# EAGLE design SMC_FrontPanel_ExtensionBoard_Step2_V14_1 (EAGLE 9.6.2)
SIZE: 0.04

## Sheet 1 of 2
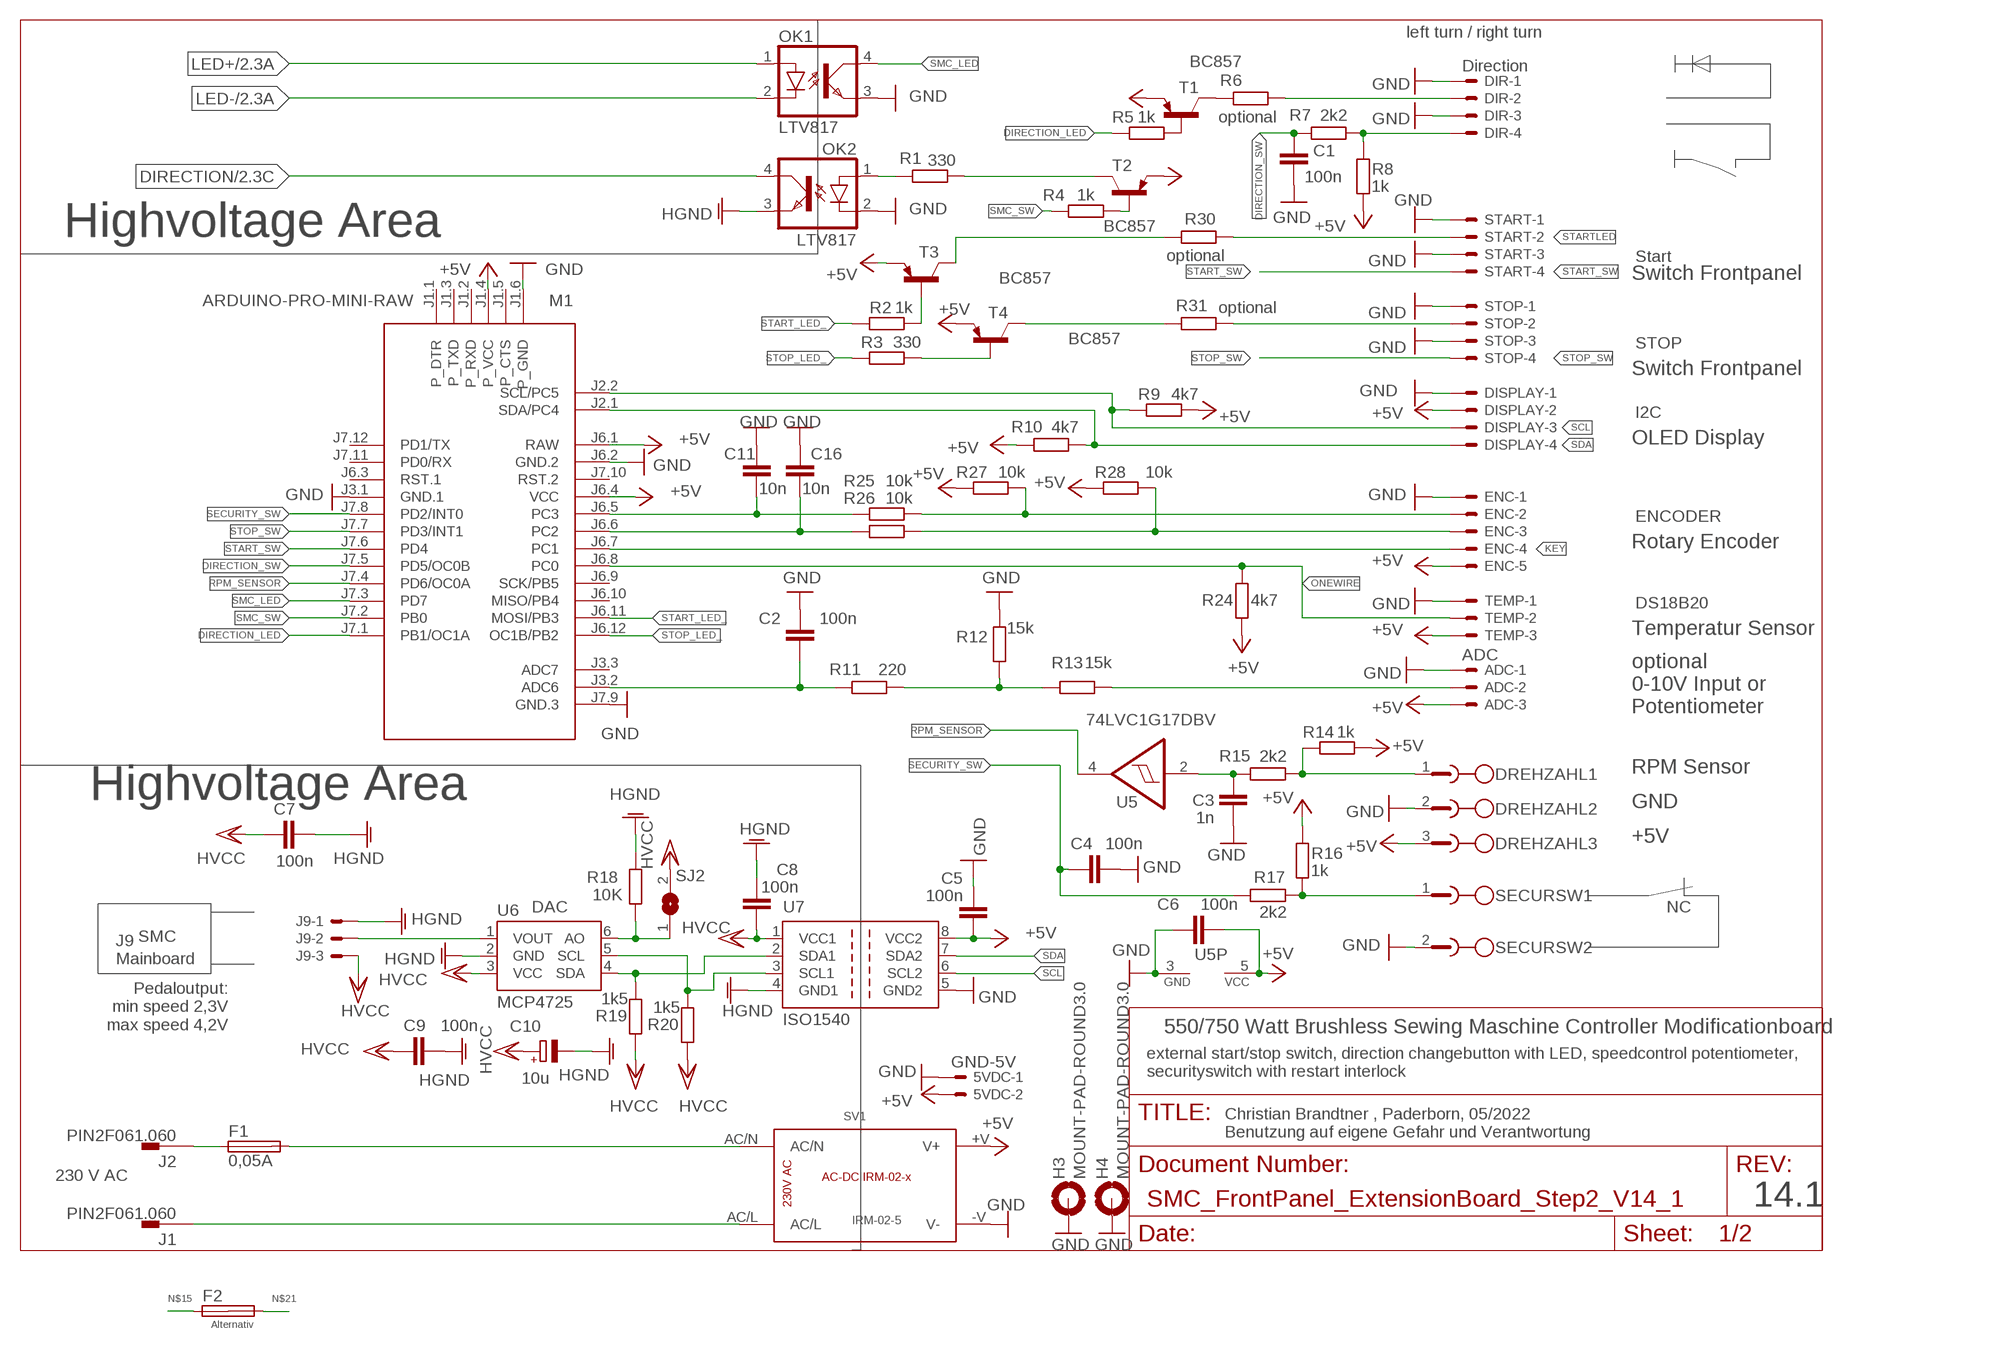
[diagram p0: schematic, sheet 1]

### Parts
5VDC  GND-5V  JST-XH-02-PIN-ROUND-PAD  [JST-XH-02-PACKAGE-ROUND-PAD]
ADC  ADC  JST-XH-03-PIN-ROUND-PAD  [JST-XH-03-PACKAGE-ROUND-PAD]
C1  100n  C-EUC0805  [C0805]
C2  100n  C-EUC0805  [C0805]
C3  1n  C-EUC0805  [C0805]
C4  100n  C-EUC0805  [C0805]
C5  100n  C-EUC0805  [C0805]
C6  100n  C-EUC0805  [C0805]
C7  100n  C-EUC0805  [C0805]
C8  100n  C-EUC0805  [C0805]
C9  100n  C-EUC0805  [C0805]
C10  10u  CPOL-EU153CLV-0405  [153CLV-0405]
C11  10n  C-EUC0805  [C0805]
C16  10n  C-EUC0805  [C0805]
DIR  Direction  JST-XH-04-PIN-ROUND-PAD  [JST-XH-04-PACKAGE-ROUND-PAD]
DISPLAY  I2C  JST-XH-04-PIN-ROUND-PAD  [JST-XH-04-PACKAGE-ROUND-PAD]
DREHZAHL  MCV_1.5/3/-G-3.5  [1843619]
ENC  ENCODER  JST-XH-05-PIN-ROUND-PAD  [JST-XH-05-PACKAGE-ROUND-PAD]
F1  0,05A  FUSE  [MTA501100]
F2  SHK20L  [SHK20L]
H3  MOUNT-PAD-ROUND3.0  [3,0-PAD]
H4  MOUNT-PAD-ROUND3.0  [3,0-PAD]
J1  PIN2F061.060  [F061.060]
J2  PIN2F061.060  [F061.060]
J9  JST-XH-03-PIN-ROUND-PAD  [JST-XH-03-PACKAGE-ROUND-PAD]
M1  ARDUINO-PRO-MINI-RAW  [ARDUINO-PRO-MINI]
OK1  LTV817  SFH6186-2  [SMD4-7]
OK2  LTV817  SFH6186-2  [SMD4-7]
R1  330  R-EU_R0805  [R0805]
R2  1k  R-EU_R0805  [R0805]
R3  330  R-EU_R0805  [R0805]
R4  1k  R-EU_R0805  [R0805]
R5  1k  R-EU_R0805  [R0805]
R6  optional  R-EU_R0805  [R0805]
R7  2k2  R-EU_R0805  [R0805]
R8  1k  R-EU_R0805  [R0805]
R9  4k7  R-EU_R0805  [R0805]
R10  4k7  R-EU_R0805  [R0805]
R11  220  R-EU_R0805  [R0805]
R12  15k  R-EU_R0805  [R0805]
R13  15k  R-EU_R0805  [R0805]
R14  1k  R-EU_R0805  [R0805]
R15  2k2  R-EU_R0805  [R0805]
R16  1k  R-EU_R0805  [R0805]
R17  2k2  R-EU_R0805  [R0805]
R18  10K  R-EU_R0805  [R0805]
R19  1k5  R-EU_R0805  [R0805]
R20  1k5  R-EU_R0805  [R0805]
R24  4k7  R-EU_R0805  [R0805]
R25  10k  R-EU_R0805  [R0805]
R26  10k  R-EU_R0805  [R0805]
R27  10k  R-EU_R0805  [R0805]
R28  10k  R-EU_R0805  [R0805]
R30  optional  R-EU_R0805  [R0805]
R31  optional  R-EU_R0805  [R0805]
SECURSW  MCV_1,5/2-G-3,5  [1843606]
SJ2  SJ  [SJ]
START  Start  JST-XH-04-PIN-ROUND-PAD  [JST-XH-04-PACKAGE-ROUND-PAD]
STOP  STOP  JST-XH-04-PIN-ROUND-PAD  [JST-XH-04-PACKAGE-ROUND-PAD]
SV1  IRM-02-5  IRM-02-X  [IRM-02-X]
T1  BC857  BC857ASMD  [SOT23-BEC]
T2  BC857  BC857ASMD  [SOT23-BEC]
T3  BC857  BC857ASMD  [SOT23-BEC]
T4  BC857  BC857ASMD  [SOT23-BEC]
TEMP  DS18B20  JST-XH-03-PIN-ROUND-PAD  [JST-XH-03-PACKAGE-ROUND-PAD]
U5  74LVC1G17DBV  [SOT23-5]
U6  MCP4725  MCP4725SOT-23  [SOT23-6]
U7  ISO1540  [SO-08]

### Nets
+5V: 5VDC.2 ADC.3 C5.1 C6.1 DISPLAY.2 DREHZAHL.3 ENC.5 M1.J1.4(P_VCC) M1.J6.1(RAW) M1.J6.4(VCC) R8.2 R9.1 R10.1 R14.1 R16.1 R24.2 R27.1 R28.1 SV1.+V(V+) T1.E T2.E T3.E T4.E TEMP.3 U5.5(VCC) U7.8(VCC2)
ADC_POTI: C2.1 M1.J3.2(ADC6) R11.1
DIRECTION: OK2.4(COL) ; also sheet 2
DIRECTION_LED: M1.J7.1(PB1/OC1A) R5.2
DIRECTION_SW: C1.2 M1.J7.5(PD5/OC0B) R7.1
GND: 5VDC.1 ADC.1 C1.1 C2.2 C3.1 C4.2 C5.2 C6.2 C11.2 C16.2 DIR.1 DIR.3 DISPLAY.1 DREHZAHL.2 ENC.1 H3.B3,0(MOUNT) H4.B3,0(MOUNT) M1.J1.6(P_GND) M1.J3.1(GND.1) M1.J6.2(GND.2) M1.J7.9(GND.3) OK1.3(EMIT) OK2.2(C) R12.2 SECURSW.2 START.1 START.3 STOP.1 STOP.3 SV1.-V(V-) TEMP.1 U5.3(GND) U7.5(GND2)
HGND: C7.1 C8.2 C9.1 C10.- J9.1 OK2.3(EMIT) R18.1 U6.2(GND) U7.4(GND1) ; also sheet 2
HVCC: C7.2 C8.1 C9.2 C10.+ J9.3 R19.2 R20.2 SJ2.2 U6.3(VCC) U7.1(VCC1) ; also sheet 2
KEY: ENC.4 M1.J6.7(PC1)
LED+: OK1.1(A) ; also sheet 2
LED-: OK1.2(C) ; also sheet 2
N$2: OK2.1(A) R1.2
N$4: J9.2 U6.1(VOUT)
N$5: R1.1 T2.C
N$6: R30.1 START.2
N$7: R2.1 T3.B
N$8: C3.2 R15.1 U5.2(I)
N$11: R3.1 T4.B
N$14: R18.2 SJ2.1 U6.6(AO)
N$15: F1.1 F2.1A J2.A1 J2.A2
N$16: DREHZAHL.1 R14.2 R15.2
N$17: R16.2 R17.2 SECURSW.1
N$18: R31.2 T4.C
N$19: R11.2 R12.1 R13.2
N$20: ADC.2 R13.1
N$21: F1.2 F2.2A SV1.AC/N
N$22: J1.A1 J1.A2 SV1.AC/L
N$23: R6.2 T1.C
N$24: DIR.2 R6.1
N$25: R5.1 T1.B
N$26: R4.1 T2.B
N$28: R20.1 U6.5(SCL) U7.3(SCL1)
N$29: DIR.4 R7.2 R8.1
N$30: C16.1 M1.J6.6(PC2) R26.1
N$31: C11.1 M1.J6.5(PC3) R25.1
N$32: ENC.2 R25.2 R27.2
N$33: ENC.3 R26.2 R28.2
N$34: R31.1 STOP.2
ONEWIRE: M1.J6.8(PC0) R24.1 TEMP.2
RPM_SENSOR: M1.J7.4(PD6/OC0A) U5.4(O)
SCL: DISPLAY.3 M1.J2.2(SCL/PC5) R9.2 U7.6(SCL2)
SDA: DISPLAY.4 M1.J2.1(SDA/PC4) R10.2 U7.7(SDA2)
SDA_HV: R19.1 U6.4(SDA) U7.2(SDA1)
SECURITY_SW: C4.1 M1.J7.8(PD2/INT0) R17.1
SMC_LED: M1.J7.3(PD7) OK1.4(COL)
SMC_SW: M1.J7.2(PB0) R4.2
START_LED_: M1.J6.11(MOSI/PB3) R2.2
START_SW: M1.J7.6(PD4) START.4
STARTLED: R30.2 T3.C
STOP_LED_: M1.J6.12(OC1B/PB2) R3.2
STOP_SW: M1.J7.7(PD3/INT1) STOP.4
Unconnected: F2.1B F2.2B M1.J1.1(P_DTR) M1.J1.2(P_RXD) M1.J1.3(P_TXD) M1.J1.5(P_CTS) M1.J3.3(ADC7) M1.J6.3(RST.1) M1.J6.9(SCK/PB5) M1.J6.10(MISO/PB4) M1.J7.10(RST.2) M1.J7.11(PD0/RX) M1.J7.12(PD1/TX)

### Notes on the sheet
- left turn / right turn
- Highvoltage Area
- Switch Frontpanel
- Switch Frontpanel
- OLED Display
- Rotary Encoder
- Temperatur Sensor
- optional
  0-10V Input or
  Potentiometer
- RPM Sensor
- Highvoltage Area
- GND
- +5V
- DAC | NC
- SMC
- J9
  Mainboard
- Pedaloutput:
  min speed 2,3V
  max speed 4,2V
- 550/750 Watt Brushless Sewing Maschine Controller Modificationboard
- external start/stop switch, direction changebutton with LED, speedcontrol potentiometer,
  securityswitch with restart interlock
- Christian Brandtner , Paderborn, 05/2022
  Benutzung auf eigene Gefahr und Verantwortung
- 230 V AC
- 14.1
- Alternativ

## Sheet 2 of 2
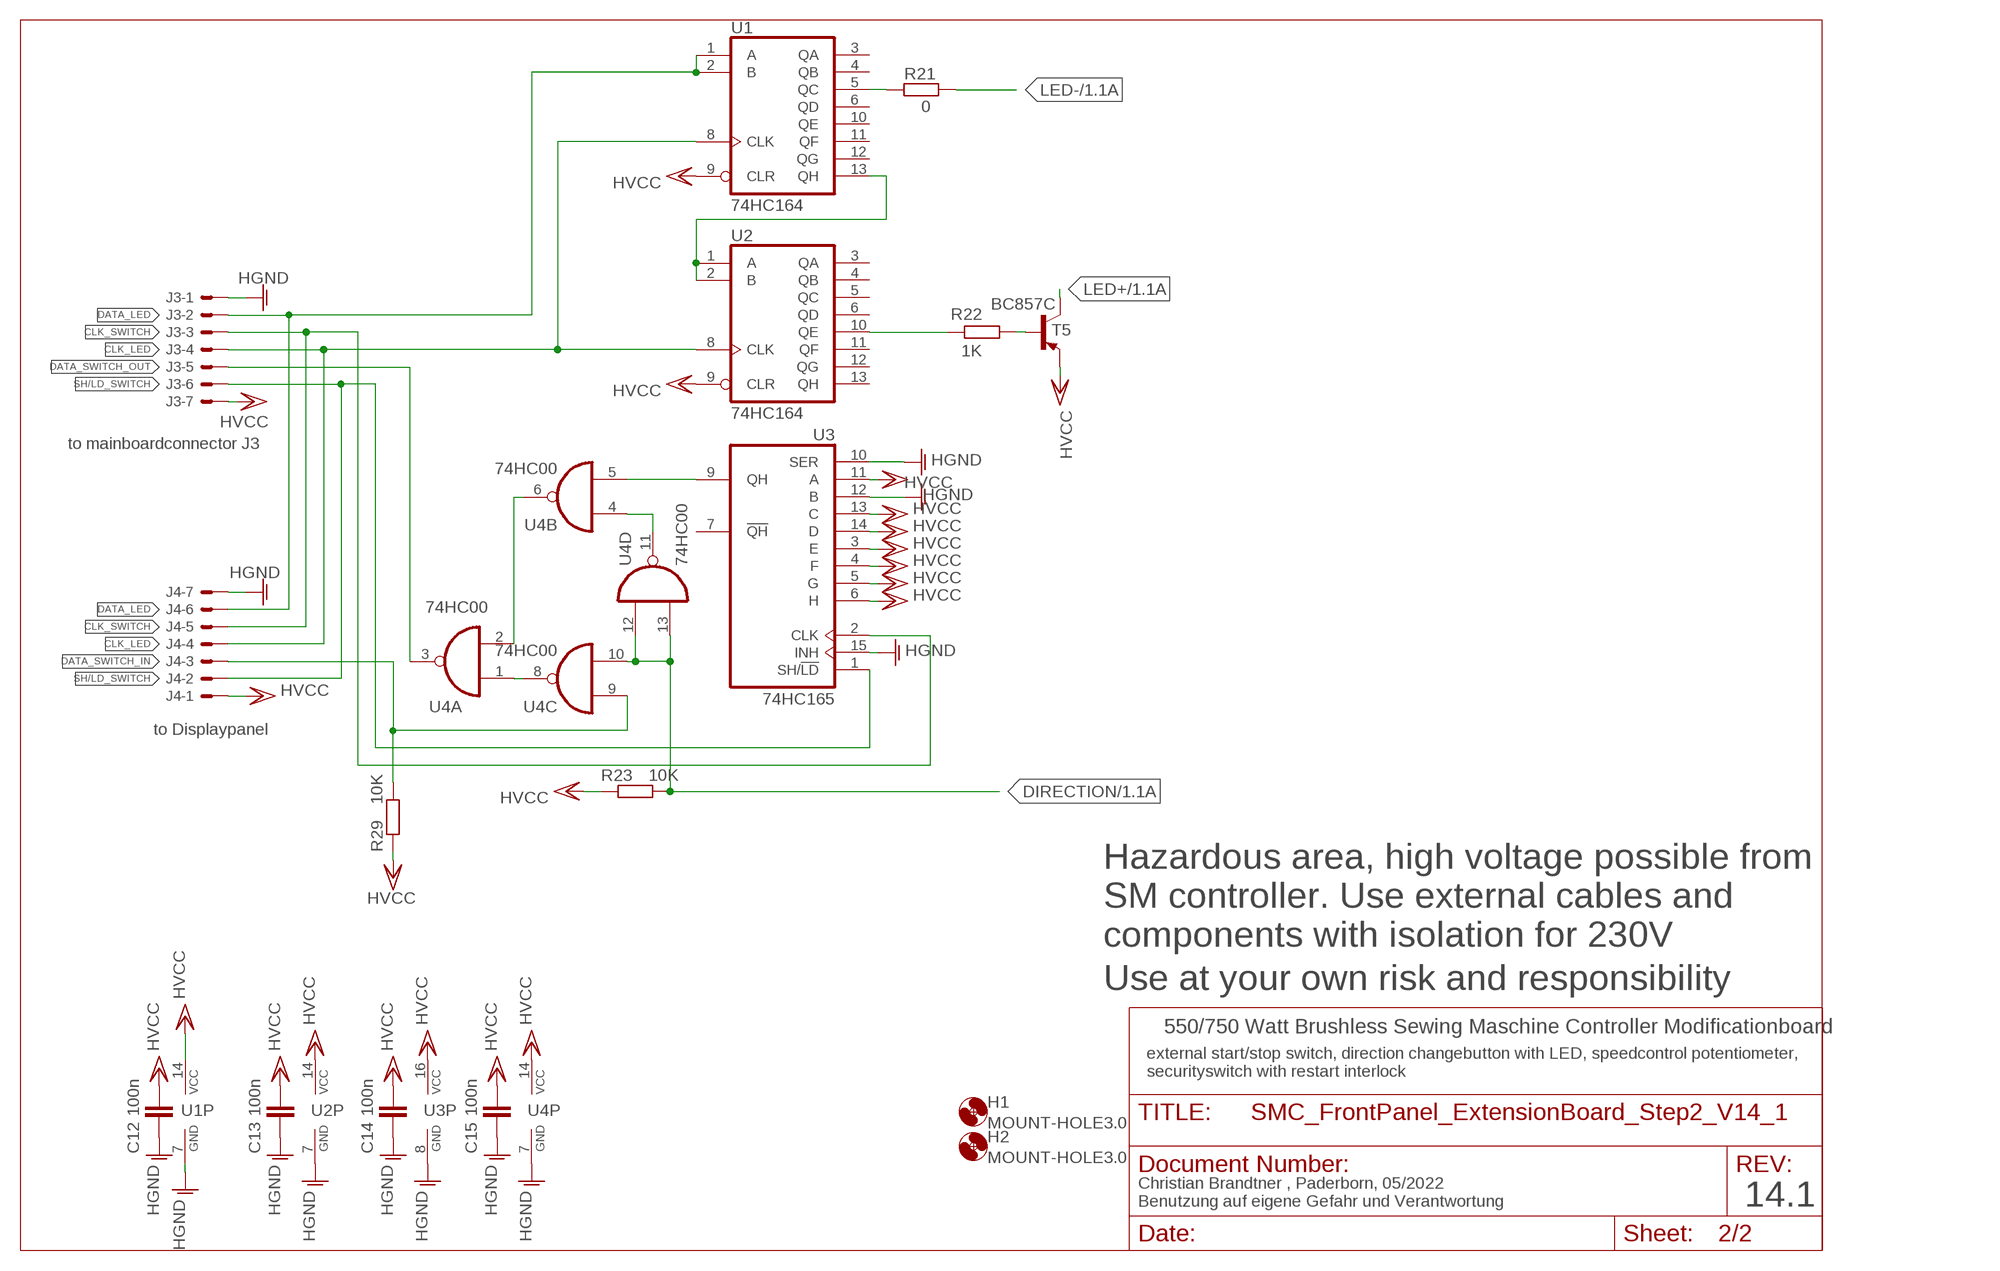
[diagram p1: schematic, sheet 2]

### Parts
C12  100n  C-EUC0805  [C0805]
C13  100n  C-EUC0805  [C0805]
C14  100n  C-EUC0805  [C0805]
C15  100n  C-EUC0805  [C0805]
H1  MOUNT-HOLE3.0  [3,0]
H2  MOUNT-HOLE3.0  [3,0]
J3  to mainboardconnector J3  JST-XH-07-PIN-ROUND-PAD  [JST-XH-07-PACKAGE-ROUND-PAD]
J4  to Displaypanel  JST-XH-07-PIN-ROUND-PAD  [JST-XH-07-PACKAGE-ROUND-PAD]
R21  0  R-EU_R0805  [R0805]
R22  1K  R-EU_R0805  [R0805]
R23  10K  R-EU_R0805  [R0805]
R29  10K  R-EU_R0805  [R0805]
T5  BC857C  BC857C-PNP-SOT23-BEC  [SOT23-BEC]
U1  74HC164  74HC164D  [SO14]
U2  74HC164  74HC164D  [SO14]
U3  74HC165  74HC165D  [SO16]
U4  74HC00  74HC00D  [SO14]

### Nets
CLK_LED: J3.4 J4.4 U1.8(CLK) U2.8(CLK)
CLK_SWITCH: J3.3 J4.5 U3.2(CLK)
DATA_LED: J3.2 J4.6 U1.1(A) U1.2(B)
DATA_SWITCH_IN: J4.3 R29.1 U4.9(C:I0)
DATA_SWITCH_OUT: J3.5 U4.3(A:O)
DIRECTION: R23.1 U4.10(C:I1) U4.12(D:I0) U4.13(D:I1) ; also sheet 1
G: U1.13(QH) U2.1(A) U2.2(B)
HGND: C12.1 C13.1 C14.1 C15.1 J3.1 J4.7 U1.7(GND) U2.7(GND) U3.8(GND) U3.10(SER) U3.12(B) U3.15(INH) U4.7(P:GND) ; also sheet 1
HVCC: C12.2 C13.2 C14.2 C15.2 J3.7 J4.1 R23.2 R29.2 T5.E U1.9(CLR) U1.14(VCC) U2.9(CLR) U2.14(VCC) U3.3(E) U3.4(F) U3.5(G) U3.6(H) U3.11(A) U3.13(C) U3.14(D) U3.16(VCC) U4.14(P:VCC) ; also sheet 1
LED+: T5.C ; also sheet 1
LED-: R21.2 ; also sheet 1
N$1: R22.1 T5.B
N$3: R21.1 U1.5(QC)
N$9: U3.9(QH) U4.5(B:I1)
N$10: U4.2(A:I1) U4.6(B:O)
N$12: U4.1(A:I0) U4.8(C:O)
N$13: U4.4(B:I0) U4.11(D:O)
N$27: R22.2 U2.10(QE)
SH/LD_SWITCH: J3.6 J4.2 U3.1(SH/!LD)
Unconnected: U1.3(QA) U1.4(QB) U1.6(QD) U1.10(QE) U1.11(QF) U1.12(QG) U2.3(QA) U2.4(QB) U2.5(QC) U2.6(QD) U2.11(QF) U2.12(QG) U2.13(QH) U3.7(!QH)

### Notes on the sheet
- Hazardous area, high voltage possible from
  SM controller. Use external cables and
  components with isolation for 230V
- Use at your own risk and responsibility
- 550/750 Watt Brushless Sewing Maschine Controller Modificationboard
- external start/stop switch, direction changebutton with LED, speedcontrol potentiometer,
  securityswitch with restart interlock
- Christian Brandtner , Paderborn, 05/2022
  Benutzung auf eigene Gefahr und Verantwortung
- 14.1

## Library data of the parts
5VDC = Rembrandt Electronics - JST XH Connectors v1-0:JST-XH-02-PIN: JST XH Connector 2 Pin Wire to board connector. Pitch: 2,54 mm, (0.100") Number of pins: 2 Created by Rembrandt Electronics www.rembrandtelectronics.com
ADC J9 TEMP = Rembrandt Electronics - JST XH Connectors v1-0:JST-XH-03-PIN: JST XH Connector 2 Pin Wire to board connector. Pitch: 2,54 mm, (0.100") Number of pins: 3 Created by Rembrandt Electronics www.rembrandtelectronics.com
C1-C9 C11-C16 = rcl:C-EU: CAPACITOR, European symbol; SPICEPREFIX: C
C10 = rcl:CPOL-EU: POLARIZED CAPACITOR, European symbol; SPICEPREFIX: C
DIR DISPLAY START STOP = Rembrandt Electronics - JST XH Connectors v1-0:JST-XH-04-PIN: JST XH Connector 2 Pin Wire to board connector. Pitch: 2,54 mm, (0.100") Number of pins: 4 Created by Rembrandt Electronics www.rembrandtelectronics.com
DREHZAHL = con-phoenix-350_CB:MCV_1.5/3/-G-3.5
ENC = Rembrandt Electronics - JST XH Connectors v1-0:JST-XH-05-PIN: JST XH Connector 2 Pin Wire to board connector. Pitch: 2,54 mm, (0.100") Number of pins: 5 Created by Rembrandt Electronics www.rembrandtelectronics.com
F1 = fuse_CB:FUSE: Fuse
F2 = fuse:SHK20L: FUSE HOLDER 5 x 20 mm, SH contact, SHH1 Schukat, E1073 Buerklin; OC_FARNELL: unknown; OC_NEWARK: unknown
H1 H2 = holes:MOUNT-HOLE: MOUNTING HOLE with drill center marker
H3 H4 = holes:MOUNT-PAD-ROUND: MOUNTING PAD, round
J1 J2 = con-faston_CB:PIN2: Flachstecker Typ Tyco/Electronics/AMP TAB, FASTON Printed Circuit Board Tabs Source: http://www.buerklin.com, http://catalog.tycoelectronics.com; OC_FARNELL: unknown; OC_NEWARK: unknown
J3 J4 = Rembrandt Electronics - JST XH Connectors v1-0:JST-XH-07-PIN: JST XH Connector 2 Pin Wire to board connector. Pitch: 2,54 mm, (0.100") Number of pins: 7 Created by Rembrandt Electronics www.rembrandtelectronics.com
M1 = diy-modules:ARDUINO-PRO-MINI-RAW
OK1 OK2 = optocoupler:SFH618?*: Optocoupler, Phototransistor Output, Low Input Current Source: Data sheet <http://www.vishay.com/docs/83673/sfh618.pdf>; MF: VISHAY/TELEFUNKEN; MPN: SFH6186-2; OC_FARNELL: 1469583; OC_NEWARK: 58K2210
R1-R31 = resistor:R-EU_: RESISTOR, European symbol
SECURSW = con-phoenix-350_CB:MCV_1,5/2-G-3,5
SJ2 = jumper:SJ: SMD solder JUMPER
SV1 = dc-dc-converter:IRM-02-X: Murata AC-DC Converter 230V AC to xV DC
T1-T4 = transistor-pnp:BC857*: PNP Transistror
T5 = transistor:*-PNP-: PNP Transistror
U1 U2 = 74xx-eu:74*164: 8-bit parallel out SHIFT REGISTER
U3 = 74xx-eu:74*165: 8-bit parallel load SHIFT REGISTER
U4 = 74xx-eu:74*00: Quad 2-input NAND gate
U5 = 74xx-little-de:74*1G17: Single Schmitt-Trigger Buffer
U6 = SparkFun-IC-Conversion:MCP4725: MCP4725 DAC Microchip 12-bit I2C DAC, SOT23-6 Datasheet <https://cdn.sparkfun.com/datasheets/BreakoutBoards/MCP4725_2009.pdf> SparkFun Products SparkFun I2C DAC Breakout - MCP4725 <https://www.sparkfun.com/products/12918> (BOB-12918); PROD_ID: IC-08886
U7 = texas_CB:ISO1540

## Board
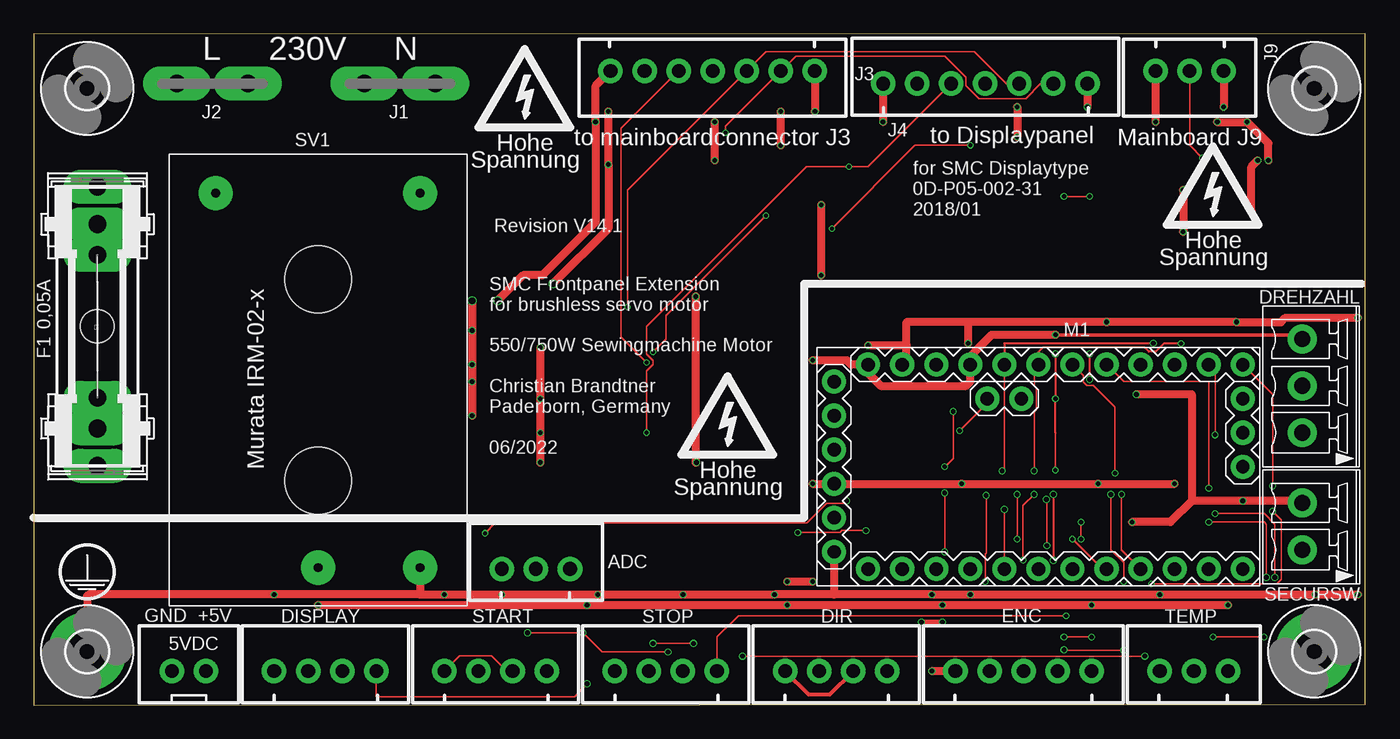
[diagram p2: board, top side]
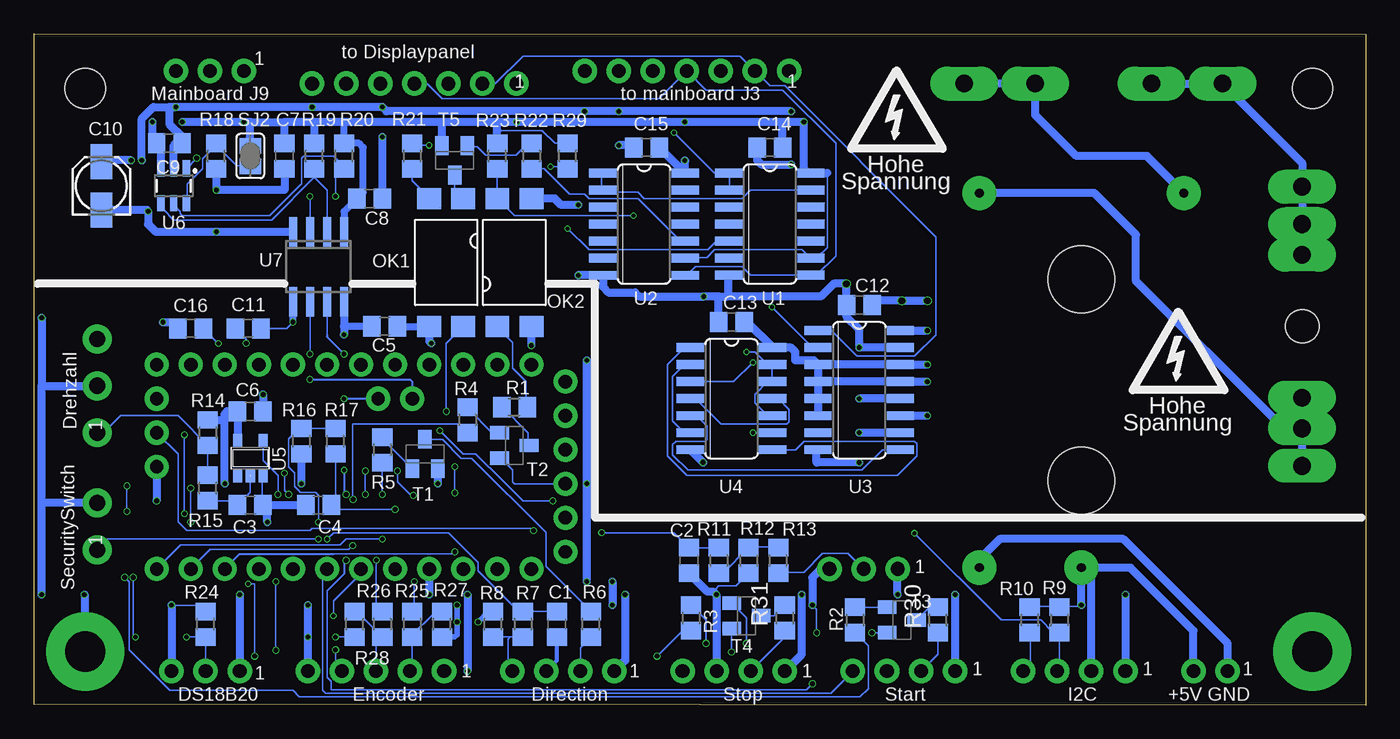
[diagram p3: board, bottom side, seen from below]

Size 99.31 x 50.09 mm. Coordinates in mm from the lower left corner, seen from the top.
Outline: 0,0 99.31,0.06 99.31,50.09 0,50.03 0,0
Copper layers (1*16): Top 0.035mm / dielectric 1.6mm / Bottom 0.035mm
Design rules "jlcpcb-2layers": minimum track width 5mil, minimum drill 0.3mm, track to track 5mil, track to pad 5mil, pad to pad 5mil, via to via 5mil, smd to smd 5mil, copper to edge 0.2mm, drill to drill 6mil, minimum pad ring 10mil, minimum via ring 3mil, stop-mask expansion 4mil, vias tented up to drill 0mil, thermal gap 10mil
tKeepout: area 0.3,31.4 to 37.8,50.5; area 0,10.5 to 17.8,31.4
bKeepout: area 0,10.2 to 17.8,31.1; area -3.5,30.8 to 34,49.8
tRestrict: area 54.6,14 to 57.8,30.5; area 15.2,14 to 57.8,16.5; area 0,14 to 15.6,16.5; area 57.8,29.2 to 61,31.1; area 81,29.2 to 99.1,34.3; area 17.8,16.5 to 32.1,31.1; area 59.4,31.1 to 61,34.3
bRestrict: area 54.6,14.6 to 57.8,30.5; area 14.6,14 to 57.1,16.5; area 61.9,29.2 to 75.2,36.2; area 57.8,29.2 to 61,31.1; area 81,29.2 to 99.1,34.3

### Footprints (pad centres in the part's own frame; a part is rotated, then mirrored left to right if it is on the bottom)
JST-XH-02-PACKAGE-ROUND-PAD = drill 1.016: 1 -1.27,0; 2 1.27,0
JST-XH-03-PACKAGE-ROUND-PAD = drill 1.016: 1 -2.54,0; 2 0,0; 3 2.54,0
C0805 = smd 1.3 x 1.5: 1 -0.95,0; 2 0.95,0
153CLV-0405 = smd 2.6 x 1.6: + 1.8,0; - -1.8,0
JST-XH-04-PACKAGE-ROUND-PAD = drill 1.016: 1 -3.81,0; 2 -1.27,0; 3 1.27,0; 4 3.81,0
1843619 = drill 1.2 pad 2: 1 0,0; 2 3.5,0; 3 7,0
JST-XH-05-PACKAGE-ROUND-PAD = drill 1.016: 1 -5.08,0; 2 -2.54,0; 3 0,0; 4 2.54,0; 5 5.08,0
MTA501100 = drill 1.321 pad 2.54 long: 1 -7.62,0; 2 7.62,0 | hole 2.5: 0,0
SHK20L = drill 1.321 pad 2.54 long: 1A -10.414,0; 1B -5.334,0; 2A 10.414,0; 2B 5.334,0
3,0 = hole 3: 0,0
3,0-PAD = drill 3 pad 5.842: B3,0 0,0
F061.060 = drill 1.3 pad 2.54 long: A1 -2.65,0; A2 2.65,0
JST-XH-07-PACKAGE-ROUND-PAD = drill 1.016: 1 -7.62,0; 2 -5.08,0; 3 -2.54,0; 4 0,0; 5 2.54,0; 6 5.08,0; 7 7.62,0
ARDUINO-PRO-MINI = drill 1: J1.1 -15.24,6.35; J1.2 -15.24,3.81; J1.3 -15.24,1.27; J1.4 -15.24,-1.27; J1.5 -15.24,-3.81; J1.6 -15.24,-6.35; J2.1 -1.27,5.08; J2.2 -3.81,5.08; J3.1 15.24,0; J3.2 15.24,2.54; J3.3 15.24,5.08; J6.1 -12.7,7.62; J6.2 -10.16,7.62; J6.3 -7.62,7.62; J6.4 -5.08,7.62; J6.5 -2.54,7.62; J6.6 0,7.62; J6.7 2.54,7.62; J6.8 5.08,7.62; J6.9 7.62,7.62; J6.10 10.16,7.62; J6.11 12.7,7.62; J6.12 15.24,7.62; J7.1 15.24,-7.62; J7.2 12.7,-7.62; J7.3 10.16,-7.62; J7.4 7.62,-7.62; J7.5 5.08,-7.62; J7.6 2.54,-7.62; J7.7 0,-7.62; J7.8 -2.54,-7.62; J7.9 -5.08,-7.62; J7.10 -7.62,-7.62; J7.11 -10.16,-7.62; J7.12 -12.7,-7.62
SMD4-7 = smd 1.78 x 1.55: 1 -1.27,-4.77; 2 1.27,-4.77; 3 1.27,4.77; 4 -1.27,4.77
R0805 = smd 1.3 x 1.5: 1 -0.95,0; 2 0.95,0
1843606 = drill 1.2 pad 2: 1 -3.5,0; 2 0,0
SJ = smd 1.168 x 1.6: 1 -0.762,0; 2 0.762,0
IRM-02-X = drill 0.65 pad 2.54: +V 0,7.6; -V 0,0; AC/L 27.94,15.24; AC/N 27.94,0 | hole 5: 6.5,7.6; 21.5,7.6
SOT23-BEC = smd 1 x 1.4: B -0.95,-1.1; C 0,1.1; E 0.95,-1.1
SO14 = smd 0.66 x 2.032: 1 -3.81,-3.073; 2 -2.54,-3.073; 3 -1.27,-3.073; 4 0,-3.073; 5 1.27,-3.073; 6 2.54,-3.073; 7 3.81,-3.073; 8 3.81,3.073; 9 2.54,3.073; 10 1.27,3.073; 11 0,3.073; 12 -1.27,3.073; 13 -2.54,3.073; 14 -3.81,3.073
SO16 = smd 0.66 x 2.032: 1 -4.445,-3.073; 2 -3.175,-3.073; 3 -1.905,-3.073; 4 -0.635,-3.073; 5 0.635,-3.073; 6 1.905,-3.073; 7 3.175,-3.073; 8 4.445,-3.073; 9 4.445,3.073; 10 3.175,3.073; 11 1.905,3.073; 12 0.635,3.073; 13 -0.635,3.073; 14 -1.905,3.073; 15 -3.175,3.073; 16 -4.445,3.073
SOT23-5 = smd 0.69 x 0.99: 1 -0.95,-1.29; 2 0,-1.29; 3 0.95,-1.29; 4 0.95,1.3; 5 -0.95,1.3
SOT23-6 = smd 0.55 x 1.2: 1 0.95,1.3; 2 0,1.3; 3 -0.95,1.3; 4 -0.95,-1.3; 5 0,-1.3; 6 0.95,-1.3
SO-08 = smd 0.6 x 2.2: 1 -1.905,-2.6; 2 -0.635,-2.6; 3 0.635,-2.6; 4 1.905,-2.6; 5 1.905,2.6; 6 0.635,2.6; 7 -0.635,2.6; 8 -1.905,2.6

### Placement (x,y rotation side)
5VDC  11.59,2.54 0 top
ADC  37.47,10.16 0 top
C1  60.33,6.03 90 bottom
C2  50.48,10.79 270 bottom
C3  83.19,14.92 180 bottom
C4  78.11,14.92 180 bottom
C5  73.18,28.26 0 bottom
C6  83.19,21.91 0 bottom
C7  80.64,40.96 90 bottom
C8  74.3,37.78 0 bottom
C9  89.22,41.91 180 bottom
C10  94.3,38.73 90 bottom
C11  83.34,28.1 0 bottom
C12  37.78,29.84 0 bottom
C13  47.31,28.57 0 bottom
C14  44.45,41.59 0 bottom
C15  53.66,41.59 0 bottom
C16  87.63,28.1 180 bottom
DIR  59.85,2.54 0 top
DISPLAY  21.75,2.54 0 top
DREHZAHL  94.61,20.32 90 top
ENC  73.82,2.54 0 top
F1  4.76,28.26 270 top
F2  4.76,28.26 270 top
H1  4,46 0 top
H2  95.5,46 0 top
H3  4,4 0 top
H4  95.5,4 0 top
J1  27.3,46.35 180 top
J2  13.34,46.35 180 top
J3  50.64,47.31 180 top
J4  70.96,46.35 0 top
J9  86.2,47.31 180 top
M1  74.93,17.78 0 top
OK1  68.58,33.02 180 bottom
OK2  63.5,33.02 0 bottom
R1  63.5,22.23 0 bottom
R2  38.1,6.35 270 bottom
R3  50.32,6.51 270 bottom
R4  66.99,21.27 270 bottom
R5  73.34,19.05 270 bottom
R6  57.78,6.03 90 bottom
R7  62.87,6.03 270 bottom
R8  65.09,6.03 90 bottom
R9  22.86,6.35 270 bottom
R10  25.08,6.35 270 bottom
R11  48.26,10.79 270 bottom
R12  46.04,10.79 270 bottom
R13  43.81,10.79 90 bottom
R14  86.36,20.32 270 bottom
R15  86.36,16.19 90 bottom
R16  79.38,19.68 90 bottom
R17  76.83,19.68 90 bottom
R18  85.72,40.96 90 bottom
R19  78.42,40.96 90 bottom
R20  76.2,40.96 90 bottom
R21  71.12,40.96 270 bottom
R22  62.23,40.96 270 bottom
R23  64.77,40.96 90 bottom
R24  86.52,6.03 90 bottom
R25  71.12,6.03 270 bottom
R26  73.34,6.03 270 bottom
R27  68.9,6.03 90 bottom
R28  75.41,6.03 90 bottom
R29  59.53,40.96 90 bottom
R30  31.91,6.35 90 bottom
R31  43.34,6.51 90 bottom
SECURSW  94.61,15.08 90 top
SJ2  83.19,40.96 90 bottom
START  34.45,2.54 0 top
STOP  47.15,2.54 0 top
SV1  28.82,10.26 90 top
T1  70.17,18.73 0 bottom
T2  63.5,19.37 270 bottom
T3  34.61,6.35 270 bottom
T4  46.2,6.67 270 bottom
T5  67.94,40.64 180 bottom
TEMP  86.52,2.54 0 top
U1  44.45,35.88 270 bottom
U2  53.83,35.87 270 bottom
U3  37.78,23.5 270 bottom
U4  47.31,22.86 270 bottom
U5  83.19,18.41 0 bottom
U6  88.9,38.73 0 bottom
U7  78.11,32.7 180 bottom
U$53  [HIGHVOLT1_TOP]  51.75,21.59 0 top
U$54  [HIGHVOLT1_TOP]  87.95,38.73 0 top
U$55  [HIGHVOLT1_BOT]  13.99,24 0 top
U$56  [HIGHVOLT1_BOT]  34.99,41.99 0 top
U$57  [HIGHVOLT1_TOP]  36.62,46 0 top
U$58  [SCHUTZLEITER]  4,10.25 0 top

### Tracks (layer width: path | path; a pad name or v marks a point on that pad's centre or on a via)
+5V  (via drill 0.35)
  Top 0.127: v36.83,5.4 v40.96,5.4 42.39,3.97 v47.31,3.97 | v76.83,5.08 v78.9,5.08
  Top 0.254: DREHZAHL.3 94.31,27.62 v76.2,27.62
  Top 0.406: v66.2,6.19 v67.77,6.19
  Top 0.61: v21.22,7.45 v41.27,7.45 v56.2,7.45 v67.77,7.45 v78.9,7.45 v89.06,7.45 | v58.1,25.72 60.64,25.72 60.96,25.4 M1.J6.1 62.23,24.77 63.18,23.81 69.53,23.81 69.85,24.13 M1.J6.4 69.85,26.02 70.53,26.7 70.53,26.72 71.44,27.62 v76.2,27.62 | v58.1,16.51 M1.J1.4 v69.22,16.51 v79.38,16.51 v85.09,16.51 | v58.1,9.21 v56.2,9.21
  Bottom 0.127: T3.E v36.83,5.4 | v41.27,7.45 40.96,7.14 v40.96,5.4 | T2.E 64.52,18.41 63.63,17.53 63.63,16.64 63.5,16.51 M1.J1.4 | 22.86,7.37 21.46,7.37 v21.22,7.45 | 22.86,7.37 25.02,7.37 R10.1 | 22.86,7.37 R9.1 | R24.2 86.99,7.45 v89.06,7.45 | R28.1 v76.83,5.08 | T4.E 47.3,3.98 v47.31,3.97
  Bottom 0.406: v67.77,7.45 v67.77,6.19 67.77,5.26 67.94,5.08 R27.1 | R8.2 65.41,6.98 v66.2,6.19
  Bottom 0.508: C5.1 76.2,28.26
  Bottom 0.61: v89.06,7.45 TEMP.3 | v78.9,7.45 v78.9,5.08 ENC.5 | DISPLAY.2 20.48,10 20.73,10.26 SV1.+V | v21.22,7.45 SV1.+V | v58.1,25.72 v58.1,16.51 v58.1,9.21 | v56.2,9.21 v56.2,7.45 | v79.38,16.51 R16.1 | U5.5 C6.1 84.93,21.91 85.09,21.75 85.09,21.27 | T1.E v69.22,16.51 | ADC.3 40.64,10.16 41.27,9.53 v41.27,7.45 | 5VDC.2 12.86,5.56 17.56,10.26 SV1.+V | U7.8 76.2,28.26 v76.2,27.62 | v85.09,16.51 85.09,21.27 | R14.1 85.09,21.27
ADC_POTI  (via drill 0.35)
  Top 0.127: v62.07,13.02 60.28,13.02 60.14,12.88 57.01,12.88 v56.99,12.86
  Bottom 0.127: M1.J3.2 88.58,18.73 88.58,13.65 87.95,13.02 78.74,13.02 78.58,13.18 62.23,13.18 v62.07,13.02 | v56.99,12.86 51.6,12.86 C2.1 R11.1
CLK_LED
  Bottom 0.127: U2.8 50.64,32.07 50.01,32.7 46.51,32.7 45.88,32.07 U1.8 40.96,32.07 39.53,33.5 39.53,41.91 43.5,45.88 49.21,45.88 J3.4 52.7,45.24 68.9,45.24 70.01,46.35 J4.4
CLK_SWITCH  (via drill 0.3)
  Top 0.127: v44.29,29.69 44.29,38.42 J3.3 54.61,48.74 70.17,48.74 72.55,46.35 J4.5
  Bottom 0.127: U3.2 41.27,26.67 v44.29,29.69
DATA_LED  (via drill 0.3)
  Top 0.127: v51.59,42.7 51.59,43.18 J3.2 56.83,48.42 67.94,48.42 69.53,46.83 69.53,46.2 70.48,45.24 73.98,45.24 75.09,46.35 J4.6
  Bottom 0.127: U1.2 47.47,38.42 47.47,39.69 U1.1 48.58,39.69 v51.59,42.7
DATA_SWITCH_IN  (via drill 0.3)
  Top 0.127: J4.3 62.23,40.16 v60.8,40.16 57.63,40.16 45.72,28.26 45.72,26.19 46.2,25.72 46.2,25.4 45.72,24.92 v45.72,20.32
  Bottom 0.127: v60.8,40.16 59.53,40.16 R29.1 | v45.72,20.32 U4.9
DATA_SWITCH_OUT  (via drill 0.3)
  Top 0.127: v45.72,25.56 43.81,27.46 43.81,43.02 J3.5
  Bottom 0.127: U4.3 47.15,24.13 v45.72,25.56
DIRECTION  (via drill 0.3)
  Top 0.127: v54.61,36.51 47.15,29.05 47.15,27.3 v46.2,26.35
  Bottom 0.127: R23.1 OK2.4 63.49,36.51 v54.61,36.51 | U4.10 44.61,21.59 45.56,22.54 45.56,23.18 44.61,24.13 44.29,24.13 | 44.29,24.13 44.29,25.08 | 44.29,25.08 44.29,25.4 U4.13 44.29,25.08 | 44.29,24.13 U4.12 | v46.2,26.35 45.56,26.35 44.29,25.08
DIRECTION_LED  (via drill 0.35)
  Top 0.127: v73.34,12.38 v73.34,15.72
  Bottom 0.127: M1.J7.1 88.39,11.94 76.48,11.94 76.04,12.38 v73.34,12.38 | v73.34,15.72 R5.2
DIRECTION_SW  (via drill 0.3)
  Top 0.127: v77.47,12.38 79.69,10.16 M1.J7.5
  Bottom 0.127: R7.1 C1.2 | R7.1 63.18,6.99 66.2,10 66.2,10.64 68.42,12.86 76.99,12.86 v77.47,12.38 | R7.1
G
  Bottom 0.127: U1.13 45.88,38.42 46.51,37.78 53.82,37.78 54.29,38.26 56.83,38.26 U2.2 56.99,38.42 56.99,39.53 U2.1
GND  (via drill 0.35)
  Top 0.127: START.3 35.31,2.54 34.16,3.68 31.78,3.68 START.1
  Top 0.305: DIR.1 57.78,0.79 59.37,0.79 DIR.3
  Top 0.61: SV1.-V 28.82,8.26 | 28.82,8.26 v30.64,8.26 v34.92,8.26 v42.07,8.26 v48.43,8.26 v55.24,8.26 59.69,8.26 | 59.69,8.26 v66.99,8.26 v69.85,8.26 v83.98,8.26 v95.57,8.26 v98.74,8.26 | 28.82,8.26 v17.94,8.26 4.13,8.26 4,8.13 H3.B3,0 | 69.69,28.57 v80.01,28.57 v89.69,28.57 93.03,28.57 93.34,28.89 v98.74,28.89 | 69.69,28.57 65.09,28.57 65.09,26.83 | 65.09,26.83 v62.23,26.83 | M1.J6.2 65.09,25.72 65.09,26.83 | M1.J1.6 59.69,8.26 | v69.69,26.99 69.69,28.57 | ENC.1 v66.99,2.54 | v82.23,23.18 86.36,23.18 86.36,15.24 | 86.36,15.24 v90.17,15.24 94.46,15.24 SECURSW.2 | v81.92,13.65 84.77,13.65 86.36,15.24
  Bottom 0.127: U5.3 82.3,17.02 82.3,15.11 C3.1 | C11.2 80.49,28.1 v80.01,28.57 | R12.2 46.99,8.89 48.26,8.89 48.47,8.68 48.47,8.26
  Bottom 0.305: DIR.3 60.33,3.33 C1.1
  Bottom 0.508: C5.2 70.64,28.25 | v80.01,28.57 U7.5
  Bottom 0.61: v83.98,8.26 TEMP.1 | H4.B3,0 95.5,8.19 v95.57,8.26 | v55.24,8.26 55.24,3.33 DIR.1 | STOP.3 v48.43,8.26 48.47,8.26 48.7,8.48 49.12,8.48 C2.2 | v34.92,8.26 ADC.1 | v30.64,8.26 START.1 | v17.94,8.26 DISPLAY.1 | v98.74,8.26 98.74,15.08 | 98.74,15.08 98.74,23.81 98.73,23.82 | v62.23,26.83 OK2.2 | v82.23,23.18 C6.2 | M1.J7.9 v69.85,8.26 | 98.73,23.82 DREHZAHL.2 | SECURSW.2 98.74,15.08 | 5VDC.1 10.32,4.6 18.1,12.38 27.3,12.38 28.82,10.87 SV1.-V | v69.69,26.99 69.85,27.15 OK1.3 70.64,28.25 | v66.99,8.26 v66.99,2.54 | M1.J3.1 v90.17,15.24 | v89.69,28.57 89.06,28.57 C16.2 | v98.74,28.89 98.74,23.83 98.73,23.82 | v81.92,13.65 81.92,14.6 C3.1 C4.2 | STOP.1 42.07,3.81 v42.07,8.26
HGND  (via drill 0.35, 0.5)
  Top 0.61: v38.73,31.43 42.86,35.56 v42.86,40.32 v42.86,44.29 | v37.78,26.67 v37.78,22.86 v37.78,20.32 v37.78,18.1 | v85.72,38.42 v85.72,35.3 | v73.34,44.61 v73.34,42.39 | v58.74,32.07 v58.74,37.31 | v49.37,30.48 49.37,18.1 v49.43,18.1 | v91.28,40.64 90.81,40.16 v90.81,36.83 | J4.7 v78.58,44.61 | J3.1 v58.26,44.29 | v55.72,41.75 v55.72,44.29 | J9.1 v88.74,44.61
  Bottom 0.61: 47.62,30.48 47.52,30.58 U1.7 | 48.26,30.48 v49.37,30.48 54.18,30.48 54.48,30.79 56.5,30.79 56.91,31.19 U2.7 v58.74,32.07 | 48.26,30.48 47.62,30.48 | C13.1 48.26,30.48 | 47.62,30.48 40.64,30.48 39.69,31.43 v38.73,31.43 C12.1 38.73,28.95 37.78,28 v37.78,26.67 U3.15 | U3.12 v37.78,22.86 | U3.10 v37.78,20.32 | v37.78,18.1 40.96,18.1 40.96,18.95 U3.8 | v49.43,18.1 U4.7 | C10.- 90.91,36.94 v90.81,36.83 90.81,35.88 90.23,35.3 v85.72,35.3 U7.4 | R18.1 v85.72,38.42 80.64,38.42 C7.1 | C14.1 45.4,40.64 45.09,40.32 v42.86,40.32 | v73.34,42.39 C8.2 | U6.2 88.9,41.75 88.74,41.91 C9.1 88.27,42.39 89.22,43.35 89.22,44.6 89.22,44.61 v88.74,44.61 | v42.86,44.29 v55.72,44.29 v58.26,44.29 73.03,44.29 v73.34,44.61 v78.58,44.61 v88.74,44.61 | v88.74,44.61 90.42,44.61 91.28,43.74 v91.28,40.64 | C15.1 54.77,41.75 v55.72,41.75 | v58.74,37.31 60.01,37.31 60.49,37.79 OK2.3
HVCC  (via drill 0.35, 0.5)
  Top 0.61: v34.61,30.16 36.51,32.07 37.94,32.07 41.91,36.04 v41.91,43.5 41.91,46.2 J3.7 | v32.7,30.16 v32.7,27.94 v32.7,25.4 v32.7,24.13 v32.7,21.59 | v50.8,40.64 v50.8,43.5 | v88.27,43.5 v90.49,43.5 92.08,41.91 v92.08,40.64 | J4.1 v63.34,43.5 | J9.3 v83.66,43.5
  Bottom 0.127: U2.9 50.67,33.4 49.15,33.4 48.58,33.97 42.07,33.97 41.43,33.34 U1.9 40.96,33.34 40.16,34.13 40.16,39.69 | 64.77,42.86 61.44,42.86 60.48,41.91 R29.2
  Bottom 0.508: U7.1 76.2,36.83 C8.1 74.77,38.26 74.77,41.59 75.09,41.91 R20.2 76.2,43.5
  Bottom 0.61: v32.7,30.16 v34.61,30.16 36.52,30.16 C12.2 | 64.77,43.5 68.9,43.5 | 68.9,43.5 76.2,43.5 78.42,43.5 | 78.42,43.5 80.64,43.5 | 83.19,43.5 80.64,43.5 | 83.19,43.5 v83.66,43.5 v88.27,43.5 | C15.2 52.67,41.59 U2.14 50.76,40.6 v50.8,40.64 | 40.16,39.69 U1.14 41.59,39.69 41.91,40 v41.91,43.5 43.5,43.5 | U3.11 v32.7,21.59 | v32.7,24.13 U3.13 U3.4 | v32.7,25.4 U3.14 U3.3 | U3.3 U3.4 | U3.4 U3.5 U3.6 | U3.16 v32.7,27.94 | U3.3 41.17,25.72 42.55,25.72 42.55,26.35 42.86,26.67 U4.14 46.14,28.57 C13.2 | T5.E 68.89,43.49 68.9,43.5 | R23.2 64.77,42.86 64.77,43.5 | v92.08,40.64 94.19,40.64 C10.+ | SJ2.2 83.19,43.5 | 78.42,43.5 78.42,43.49 R19.2 | C7.2 80.64,43.5 | 43.5,43.5 v50.8,43.5 v63.34,43.5 64.77,43.5 | C14.2 43.5,43.49 43.5,43.5 | U6.3 89.85,41.59 C9.2 90.49,42.23 v90.49,43.5
KEY  (via drill 0.35)
  Top 0.127: M1.J6.7 78.3,24.57 78.3,24.11 78.56,23.85 79.02,23.85 80.64,22.23 v80.64,17.3 | v80.33,15.72 80.33,11.59 81.28,10.64 v81.28,9.21 | v81.28,4.09 76.88,4.09 v76.83,4.13
  Bottom 0.127: v80.33,15.72 80.64,16.03 v80.64,17.3 | v76.83,4.13 76.83,3.02 ENC.4 | v81.28,9.21 v81.28,4.09
LED+
  Bottom 0.127: T5.C 67.94,38.48 67.31,37.85 OK1.1
LED-
  Bottom 0.127: R21.2 71.12,39.12 69.85,37.85 OK1.2
N$1
  Bottom 0.127: T5.B 66.93,41.66 66.29,41.66 65.66,41.02 63.37,41.02 62.61,41.78 62.23,41.78 R22.1
N$2
  Bottom 0.127: R1.2 62.61,22.23 62.61,24.13 63.63,25.15 63.63,27.05 64.77,28.19 OK2.1
N$3  (via drill 0.3)
  Top 0.127: v69.85,41.75 65.72,41.75 v59.53,35.56
  Bottom 0.127: v69.85,41.75 71.12,41.75 R21.1 | v59.53,35.56 57.94,33.97 49.05,33.97 48.42,34.61 U1.5
N$4  (via drill 0.35)
  Top 0.127: v87.18,40.8 87.15,40.8 86.2,41.75 J9.2
  Bottom 0.127: v87.18,40.8 U6.1
N$5
  Bottom 0.127: T2.C 62.48,19.43 62.48,20.32 64.39,22.23 R1.1
N$6
  Bottom 0.127: START.2 31.91,3.81 R30.1
N$7
  Bottom 0.127: T3.B R2.1
N$8
  Bottom 0.127: U5.2 83.19,15.88 84.07,14.99 C3.2 84.2,14.99 84.45,15.24 R15.1
N$9
  Bottom 0.127: U3.9 36.07,19.05 37.59,17.53 50.55,17.53 51.69,18.67 51.69,19.43 51.44,19.68 49.28,19.68 49.15,19.81 49.15,20.83 49.91,21.59 U4.5
N$10
  Bottom 0.127: U4.6 50.8,20.32 51.69,21.21 51.69,24.51 50.8,25.4 U4.2
N$11  (via drill 0.35)
  Top 0.127: v46.2,4.6 v49.21,4.6
  Bottom 0.127: T4.B 46.2,6.52 v46.2,4.6 | v49.21,4.6 49.21,6.35 R3.1
N$12
  Bottom 0.127: U4.8 42.55,19.05 41.91,19.68 33.66,19.68 33.5,19.53 33.5,18.57 34.92,17.14 50.64,17.14 52.07,18.57 52.07,25.4 50.8,26.67 U4.1
N$13
  Bottom 0.127: U4.11 43.81,22.86 43.02,22.07 43.02,21.11 43.18,20.95 48.1,20.95 50.01,22.86 U4.4
N$14
  Bottom 0.127: 85.72,41.78 86.74,40.77 86.74,40.01 87.88,38.86 87.88,37.47 U6.6 | 85.72,41.78 84.2,40.26 83.19,40.26 SJ2.1 | 85.72,41.78 R18.2
N$15
  Bottom 0.61: J2.A1 J2.A2 4.76,40.43 F2.1A F1.1
N$16
  Bottom 0.127: R15.2 R14.2 88.58,21.59 92.87,21.59 94.14,20.32 DREHZAHL.1
N$17  (via drill 0.35)
  Top 0.127: v78.11,13.65 v78.11,12.38
  Bottom 0.127: R17.2 R16.2 79.54,20.64 80.33,19.84 80.33,17.78 79.87,17.32 79.87,16.3 79.52,15.96 79.52,15.86 78.33,15.86 78.11,15.64 v78.11,13.65 | SECURSW.1 93.81,12.38 v78.11,12.38
N$18
  Bottom 0.127: T4.C 44.13,6.67 R31.2
N$19
  Bottom 0.127: R13.2 43.81,11.81 45.97,11.81 R12.1 46.1,11.68 47.88,9.91 48.26,9.91 R11.2
N$20
  Bottom 0.127: ADC.2 38.61,11.3 40.51,11.3 41.91,9.91 43.81,9.91 R13.1
N$21
  Bottom 0.61: F2.2A F1.2 5.35,21.22 6.74,21.22 17.14,31.63 17.14,35.08 20.26,38.2 SV1.AC/N
N$22
  Bottom 0.61: SV1.AC/L 16.32,40.96 21.59,40.96 24.66,44.02 J1.A2 J1.A1
N$23
  Bottom 0.127: T1.C 70.1,19.81 68.87,19.81 67.47,18.41 66.67,18.41 61.14,12.88 61.14,10.34 R6.2
N$24
  Bottom 0.127: R6.1 58.58,4.29 DIR.2
N$25
  Bottom 0.127: T1.B 71.12,17.65 73.41,19.94 R5.1
N$26
  Bottom 0.127: T2.B 64.64,20.32 65.15,20.32 66.93,22.1 R4.1
N$27
  Bottom 0.127: U2.10 50.8,34.61 51.12,34.61 54.29,37.78 57.94,37.78 58.26,38.1 59.37,38.1 61.28,40.01 R22.2
N$28  (via drill 0.35)
  Top 0.127: v76.83,37.94 v78.74,37.94
  Bottom 0.127: U6.5 88.9,37.31 88.42,36.83 88.42,36.67 88.27,36.51 81.76,36.51 79.38,38.89 79.38,40.8 79.22,40.96 76.99,40.96 76.2,40.16 R20.1 76.83,39.37 v76.83,37.94 | v78.74,37.94 U7.3
N$29
  Bottom 0.127: 63.82,5.08 65.02,5.08 R8.1 | 63.82,5.08 R7.2 | DIR.4 63.98,2.86 63.98,4.92 63.82,5.08
N$30  (via drill 0.3, 0.35)
  Top 0.127: v73.79,10.83 73.79,14.89 v74.61,15.72 | M1.J6.6 74.61,25.08 74.61,23.81 74.77,23.65 74.77,22.07 74.61,21.91 v74.61,17.46
  Top 0.152: v85.57,26.99 84.3,26.99 83.68,26.37 83.16,26.37 82.86,26.67 75.25,26.67 74.93,26.35 M1.J6.6
  Bottom 0.127: v85.57,26.99 C16.1 | v73.79,10.83 73.82,10.79 73.82,7.46 R26.1 | v74.61,17.46 v74.61,15.72
N$31  (via drill 0.35)
  Top 0.127: M1.J6.5 72.39,17.62 72.23,17.46 v72.21,17.46 | v71.04,15.64 71.04,11.35 70.96,11.27 v70.96,9.21
  Top 0.152: v83.5,26.99 72.39,26.99 M1.J6.5
  Bottom 0.127: v72.21,17.46 72.21,16.65 71.12,15.56 v71.04,15.64 | R25.1 70.96,7.14 v70.96,9.21
  Bottom 0.152: C11.1 83.5,27.31 v83.5,26.99
N$32
  Bottom 0.127: ENC.2 71.12,2.7 R25.2 71.12,5.24 69.53,6.83 68.9,6.83 R27.2
N$33
  Bottom 0.127: 73.82,5.08 R26.2 | ENC.3 73.82,5.08 | 73.82,5.08 R26.2 | R26.2 75.24,6.98 R28.2
N$34
  Bottom 0.127: STOP.2 43.34,5.08 R31.1
ONEWIRE  (via drill 0.35)
  Top 0.127: M1.J6.8 81.28,24.13 87.63,24.13 v87.63,16.19 | v87.63,13.65 91.76,13.65 91.92,13.49 v91.92,9.53 | v91.76,5.08 v87.95,5.08
  Bottom 0.127: v87.63,16.19 v87.63,13.65 | v91.92,9.53 91.92,5.24 v91.76,5.08 | v87.95,5.08 R24.1 | R24.1 | TEMP.2 R24.1
RPM_SENSOR  (via drill 0.35)
  Top 0.127: v81.12,15.72 81.12,11.59 M1.J7.4
  Bottom 0.127: U5.4 82.23,18.26 81.12,17.14 v81.12,15.72
SCL  (via drill 0.3, 0.35)
  Top 0.127: v69.06,20.48 71.12,22.54 M1.J2.2 | v60.64,15.24 60.46,15.06 59.12,15.06 57.65,13.59 34.42,13.59 v33.66,12.83
  Top 0.152: v78.74,26.19 v78.74,24.29
  Bottom 0.127: DISPLAY.3 22.86,2.7 R9.2 22.86,5.46 23.37,5.46 24.26,6.35 27.18,6.35 v33.66,12.83 | v69.06,20.48 67.31,18.73 66.38,18.73 65.38,17.73 65.35,17.73 62.87,15.24 v60.64,15.24 | U7.6 v78.74,26.19
  Bottom 0.152: v78.74,24.29 71.28,24.29 71.12,24.13 M1.J2.2
SDA  (via drill 0.3, 0.35)
  Top 0.127: v76.2,17.53 76.2,20.32 | v41.27,1.59 40.32,0.64 25.56,0.64 DISPLAY.4
  Top 0.152: 76.2,20.32 v76.2,22.86 v76.2,26.19 | v76.04,15.72 v76.04,10.79
  Bottom 0.127: R10.2 25.02,5.33 25.02,3.08 DISPLAY.4 | v41.27,1.59 41.72,1.14 77.15,1.14 77.15,1.77 77.46,2.08 77.46,8.52 76.2,9.78 | U7.7 77.47,27.62
  Bottom 0.152: v76.2,22.86 M1.J2.1 | 77.47,27.62 77.47,27.46 v76.2,26.19 | v76.2,17.53 76.2,15.88 v76.04,15.72 | v76.04,10.79 76.2,10.64 76.2,9.78
SDA_HV
  Bottom 0.127: 78.42,39.37 81.6,36.2 88.9,36.2 89.69,36.99 89.69,37.31 U6.4 | R19.1 78.42,39.37 | 78.42,39.37 77.47,38.42 U7.2
SECURITY_SW  (via drill 0.35)
  Top 0.127: v72.39,14.61 M1.J7.8
  Bottom 0.127: R17.1 76.83,15.24 77.09,14.99 C4.1 76.84,14.61 v72.39,14.61
SH/LD_SWITCH
  Bottom 0.127: U3.1 39.85,27.94 37.94,26.04 33.66,26.04 32.07,27.62 32.07,34.92 43.34,46.2 44.45,46.2 J3.6 46.67,48.42 62.87,48.42 64.93,46.35 J4.2
SMC_LED  (via drill 0.35)
  Top 0.127: v68.58,21.91 68.58,18.41 v67.94,17.78 | v67.94,11.43 v67.94,15.83
  Bottom 0.127: OK1.4 68.58,26.98 v68.58,21.91 | 76.99,11.27 68.1,11.27 v67.94,11.43 | v67.94,15.83 v67.94,17.78
  Bottom 0.152: M1.J7.3 83.98,11.27 76.99,11.27
SMC_SW  (via drill 0.35)
  Top 0.127: v75.56,11.91 75.56,15.3 v75.52,15.35
  Bottom 0.127: R4.2 67.62,20.95 75.56,20.95 75.56,15.4 v75.52,15.35 | M1.J7.2 86.17,11.62 75.85,11.62 v75.56,11.91
START_LED_  (via drill 0.35)
  Top 0.127: v92.55,9.53 92.55,13.49 91.76,14.29 v88.11,14.29 | v88.11,20.16 88.11,24.92 M1.J6.11
  Bottom 0.127: v92.55,9.53 92.23,9.21 92.23,4.13 89.22,1.11 80.01,1.11 79.53,0.64 37.72,0.64 37.12,1.24 37.12,4.42 R2.2 | v88.11,14.29 v88.11,20.16
START_SW
  Bottom 0.127: START.4 39.91,0.89 77.56,0.89 77.79,1.11 77.79,9.84 M1.J7.6
STARTLED
  Bottom 0.127: T3.C 32.56,7.3 R30.2
STOP_LED_  (via drill 0.3, 0.35)
  Top 0.127: v52.86,3.65 v52.87,3.65 81.46,3.65 81.47,3.65 v82.87,3.65 | v92.39,14.45 93.03,13.81 93.03,9.38 92.7,9.05 v83.34,9.05 | v92.39,16.35 92.39,23.18 M1.J6.12
  Bottom 0.127: v82.87,3.65 82.87,9.05 v83.34,9.05 | v92.39,14.45 v92.39,16.35 | v52.86,3.65 50.96,5.56 R3.2
STOP_SW  (via drill 0.3)
  Top 0.127: v76.99,6.67 52.55,6.67 50.96,5.08 STOP.4
  Bottom 0.127: M1.J7.7 74.93,9.84 76.99,7.78 v76.99,6.67

### Text on the board
tPlace: Mainboard J9 | for SMC Displaytype / 0D-P05-002-31 / 2018/01 | Revision V14.1 | 0,05A | SMC Frontpanel Extension / for brushless servo motor / / 550/750W Sewingmachine Motor / / Christian Brandtner / Paderborn, Germany / / 06/2022 | GND +5V
bPlace: 1 | to Displaypanel | 1 | 1 | to mainboard J3 | Mainboard J9 | Drehzahl | 1 | SecuritySwitch | 1 | 1 | 1 | 1 | 1 | 1 | 1 | 1 | 1 | +5V GND | I2C | Start | Stop | Direction | Encoder | DS18B20
tNames: L 230V N
202bmp: /home/cebra/EAGLE/danger_sw.bmp